# Altium schematic sheet TOP_PDUA_V1.SchDoc
size 635 x 241 mm
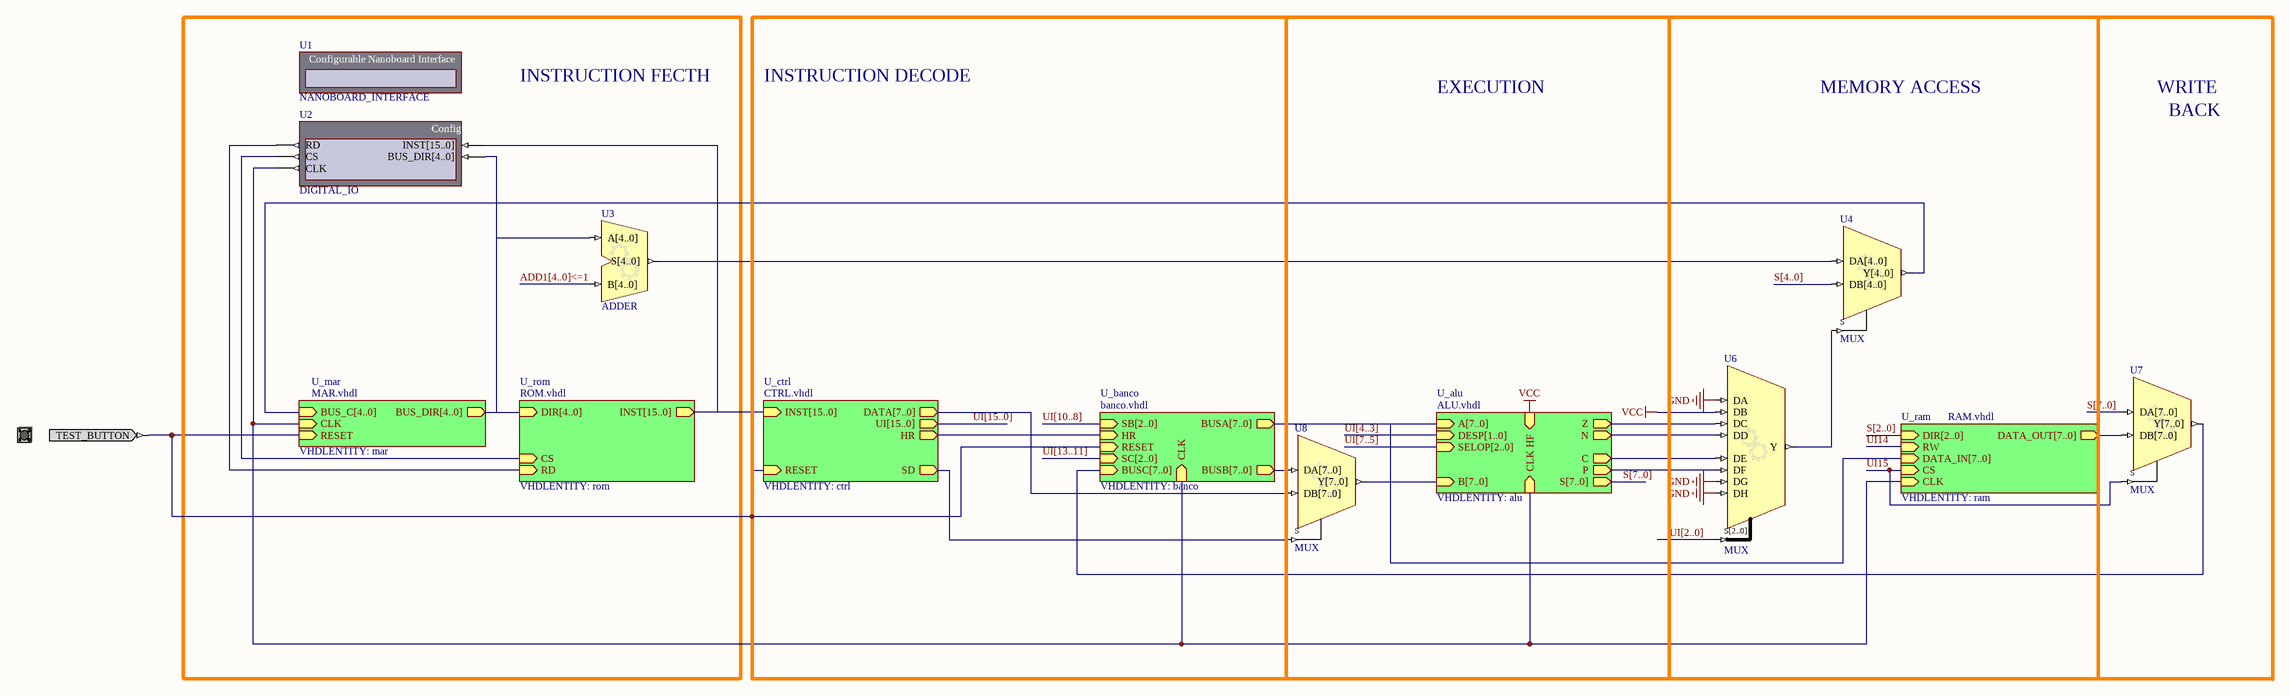
[diagram p0: TOP_PDUA_V1.SchDoc]

## Parts
?  TEST_BUTTON  (value not drawn)
U1  NANOBOARD_INTERFACE
U2  DIGITAL_IO
U3  ADDER
U4  MUX
U6  MUX
U7  MUX
U8  MUX

## Blocks framed on the sheet
INSTRUCTION FECTH: U1-U3
EXECUTION: U8
MEMORY ACCESS: U4 U6

## Sub-sheets
U_alu = ALU.vhdl: A[7..0] (in), B[7..0] (in), C (out), DESP[1..0] (in), HF (in), N (out), P (out), S[7..0] (out), SELOP[2..0] (in), Z (out), CLK (in)  | VHDLENTITY: alu
U_banco = banco.vhdl: BUSA[7..0] (out), BUSB[7..0] (out), BUSC[7..0] (in), HR (in), SB[2..0] (in), SC[2..0] (in), RESET (in), CLK (in)  | VHDLENTITY: banco
U_ctrl = CTRL.vhdl: DATA[7..0] (out), INST[15..0] (in), RESET (in), UI[15..0] (out), SD (out), HR (out)  | VHDLENTITY: ctrl
U_mar = MAR.vhdl: BUS_C[4..0] (in), BUS_DIR[4..0] (out), CLK (in), RESET (in)  | VHDLENTITY: mar
U_ram = RAM.vhdl: CS (in), DATA_IN[7..0] (in), DATA_OUT[7..0] (out), DIR[2..0] (in), RW (in), CLK (in)  | VHDLENTITY: ram
U_rom = ROM.vhdl: CS (in), DIR[4..0] (in), RD (in), INST[15..0] (out)  | VHDLENTITY: rom

## Nets
GND: U6.DA U6.DG U6.DH
VCC: U6.DB ; sheet U_alu/HF
ADD1[4..0]<=1: U3.B[4..0]
S[4..0]: U4.DB[4..0]
S[7..0]: U7.DA[7..0] ; sheet U_alu/S[7..0]
UI14: sheet U_ram/RW
UI15: U7.S ; sheet U_ram/CS
UI[2..0]: U6.S[2..0]
Net?_TEST_BUTTON: ?.TEST_BUTTON ; sheet U_mar/RESET, sheet U_ctrl/RESET, sheet U_banco/RESET
NetU2_BUS_DIR[4..0]: U2.BUS_DIR[4..0] U3.A[4..0] ; sheet U_rom/DIR[4..0], sheet U_mar/BUS_DIR[4..0]
NetU2_CLK: U2.CLK ; sheet U_mar/CLK, sheet U_banco/CLK, sheet U_alu/CLK, sheet U_ram/CLK
NetU2_CS: U2.CS ; sheet U_rom/CS
NetU2_INST[15..0]: U2.INST[15..0] ; sheet U_rom/INST[15..0], sheet U_ctrl/INST[15..0]
NetU2_RD: U2.RD ; sheet U_rom/RD
NetU3_S[4..0]: U3.S[4..0] U4.DA[4..0]
NetU4_S: U4.S U6.Y
NetU4_Y[4..0]: U4.Y[4..0] ; sheet U_mar/BUS_C[4..0]
NetU6_DC: U6.DC ; sheet U_alu/Z
NetU6_DD: U6.DD ; sheet U_alu/N
NetU6_DE: U6.DE ; sheet U_alu/C
NetU6_DF: U6.DF ; sheet U_alu/P
NetU7_DB[7..0]: U7.DB[7..0] ; sheet U_ram/DATA_OUT[7..0]
NetU7_Y[7..0]: U7.Y[7..0] ; sheet U_banco/BUSC[7..0]
NetU8_DA[7..0]: U8.DA[7..0] ; sheet U_banco/BUSB[7..0]
NetU8_DB[7..0]: U8.DB[7..0] ; sheet U_ctrl/DATA[7..0]
NetU8_S: U8.S ; sheet U_ctrl/SD
NetU8_Y[7..0]: U8.Y[7..0] ; sheet U_alu/B[7..0]
(unnamed): sheet U_ctrl/HR, sheet U_banco/HR

## Buses and harness runs
bus ADD1[4..0]<=1
bus S[2..0] = sheet U_ram/DIR[2..0]
bus S[4..0]
bus S[7..0]
bus S[7..0] = sheet U_alu/S[7..0]
bus sheet U_alu/A[7..0] = sheet U_banco/BUSA[7..0] = sheet U_ram/DATA_IN[7..0]
bus sheet U_ctrl/INST[15..0] = sheet U_rom/INST[15..0]
bus sheet U_mar/BUS_DIR[4..0] = sheet U_rom/DIR[4..0]
bus UI[2..0]
bus UI[4..3] = sheet U_alu/DESP[1..0]
bus UI[7..5] = sheet U_alu/SELOP[2..0]
bus UI[10..8] = sheet U_banco/SB[2..0]
bus UI[13..11] = sheet U_banco/SC[2..0]
bus UI[15..0] = sheet U_ctrl/UI[15..0]

## Notes on the sheet
- INSTRUCTION DECODE
- WRITE
- BACK

## Library data of the parts
? = TEST_BUTTON: Test / Reset Button; PortComponent: True; Published: 19-Nov-2003; Publisher: Altium Limited; HelpURL: https://wiki.altium.com/display/ADOH/NanoBoard+3000+-+Test-Reset+Button
U1 = NANOBOARD_INTERFACE: Configurable Nanoboard Interface; NEXUS_CORE: Instrument; NEXUS_JTAG_DEVICE: True; NEXUS_JTAG_ORDER: 0; ConfiguratorName: DIGITAL_IO_APPLICATION; ConfigurationParameters: {}Version[1.0]{}StorageType[0]{}SubProjectPath[ ]{}ID[{671E93E2-1352-47BB-8601-7B53E1649ABB}]{}DisabledInDashboard[False]{}AutoRun[False]{}; ComponentLink1Description: Core &Resource Usage; ComponentLink1URL: CR0134 FPGA Instrument Resource Usage.pdf; Core Revision: 1.00.00; HelpURL: https://wiki.altium.com/display/ADOH/Connected+FPGA+Scripts; LastRevisionNo: 1.00.00; Published: 06-May-2009; Publisher: Altium Limited
U2 = DIGITAL_IO: Configurable Digital IO; NEXUS_CORE: Instrument; NEXUS_JTAG_DEVICE: True; NEXUS_JTAG_ORDER: 0; ConfigurationParameters: {}Version[2.0]{}StorageType[3]{}InterfaceType[Parallel]{}SchCompWidth[140]{}Input0Name[INST{1}15..0{2}]{}Input0Width[16]{}Input0InitValue[0]{}Input0Kind[Numeric]{}Input0NumRadix[Binary]{}Input1Name[BUS_DIR{1}4..0{2}]{}Input1Width[5]{}Input1InitValue[0]{}Input1Kind[Numeric]{}Input1NumRadix[Binary]{}Output0Name[RD]{}Output0Width[1]{}Output0InitValue[0]{}Output0Kind[Numeric]{}Output0NumRadix[Binary]{}Output1Name[CS]{}Output1Width[1]{}Output1InitValue[0]{}Output1Kind[Numeric]{}Output1NumRadix[Binary]{}Output2Name[CLK]{}Output2Width[1]{}Output2InitValue[0]{}Output2Kind[Numeric]{}Output2NumRadix[Binary]{}Designator[U2]{}InternalID[1]{}; ConfiguratorName: DIGITAL_IO; ComponentLink1Description: Core &Resource Usage; ComponentLink1URL: CR0134 FPGA Instrument Resource Usage.pdf; Core Revision: 1.00.00; HelpURL: https://wiki.altium.com/display/ADOH/Digital+IO+Module; LastRevisionNo: 1.00.00; Published: 28-Jun-2007; Publisher: Altium Limited; UseInDSF: True
U3 = ADDER: Configurable Adder; ConfiguratorName: GENERIC_ADDER; ConfigurationParameters: {}Version[1.0]{}Type[Adder]{}SignedOverflow[False]{}UnsignedCarryOut[False]{}SignalWidth[5]{}BusInputs[True]{}BusOutput[True]{}RegisterOutputs[False]{}NegClockEdge[False]{}CarryIn[False]{}; LastRevisionNo: 1.00.00; Published: 23-Jan-2009; Publisher: Altium Limited
U4 = MUX: Configurable Mutliplexer; ConfigurationParameters: {}Version[1.0]{}ShowEnable[False]{}BusInputs[True]{}BusOutputs[True]{}SignalWidth[5]{}Type[Multiplexer]{}RegisterOutputs[False]{}NegativeClockEdge[False]{}ShowPinNames[True]{}InvertSingleSignal[False]{}SignalCount[2]{}Invert0[False]{}Invert1[False]{}; ConfiguratorName: GENERIC_MULTIPLEXER; LastRevisionNo: 1.00.00; Published: 31-Dec-2008; Publisher: Altium Limited
U6 = MUX: Configurable Mutliplexer; ConfigurationParameters: {}Version[1.0]{}ShowEnable[False]{}BusInputs[False]{}BusOutputs[False]{}SignalWidth[1]{}Type[Multiplexer]{}RegisterOutputs[False]{}NegativeClockEdge[False]{}ShowPinNames[True]{}InvertSingleSignal[False]{}SignalCount[8]{}Invert0[False]{}Invert1[False]{}Invert2[False]{}Invert3[False]{}Invert4[False]{}Invert5[False]{}Invert6[False]{}Invert7[False]{}; ConfiguratorName: GENERIC_MULTIPLEXER; LastRevisionNo: 1.00.00; Published: 31-Dec-2008; Publisher: Altium Limited
U7 U8 = MUX: Configurable Mutliplexer; ConfigurationParameters: {}Version[1.0]{}ShowEnable[False]{}BusInputs[True]{}BusOutputs[True]{}SignalWidth[8]{}Type[Multiplexer]{}RegisterOutputs[False]{}NegativeClockEdge[False]{}ShowPinNames[True]{}InvertSingleSignal[False]{}SignalCount[2]{}Invert0[False]{}Invert1[False]{}; ConfiguratorName: GENERIC_MULTIPLEXER; LastRevisionNo: 1.00.00; Published: 31-Dec-2008; Publisher: Altium Limited